# EAGLE design uino-32u4 (EAGLE 5.11)
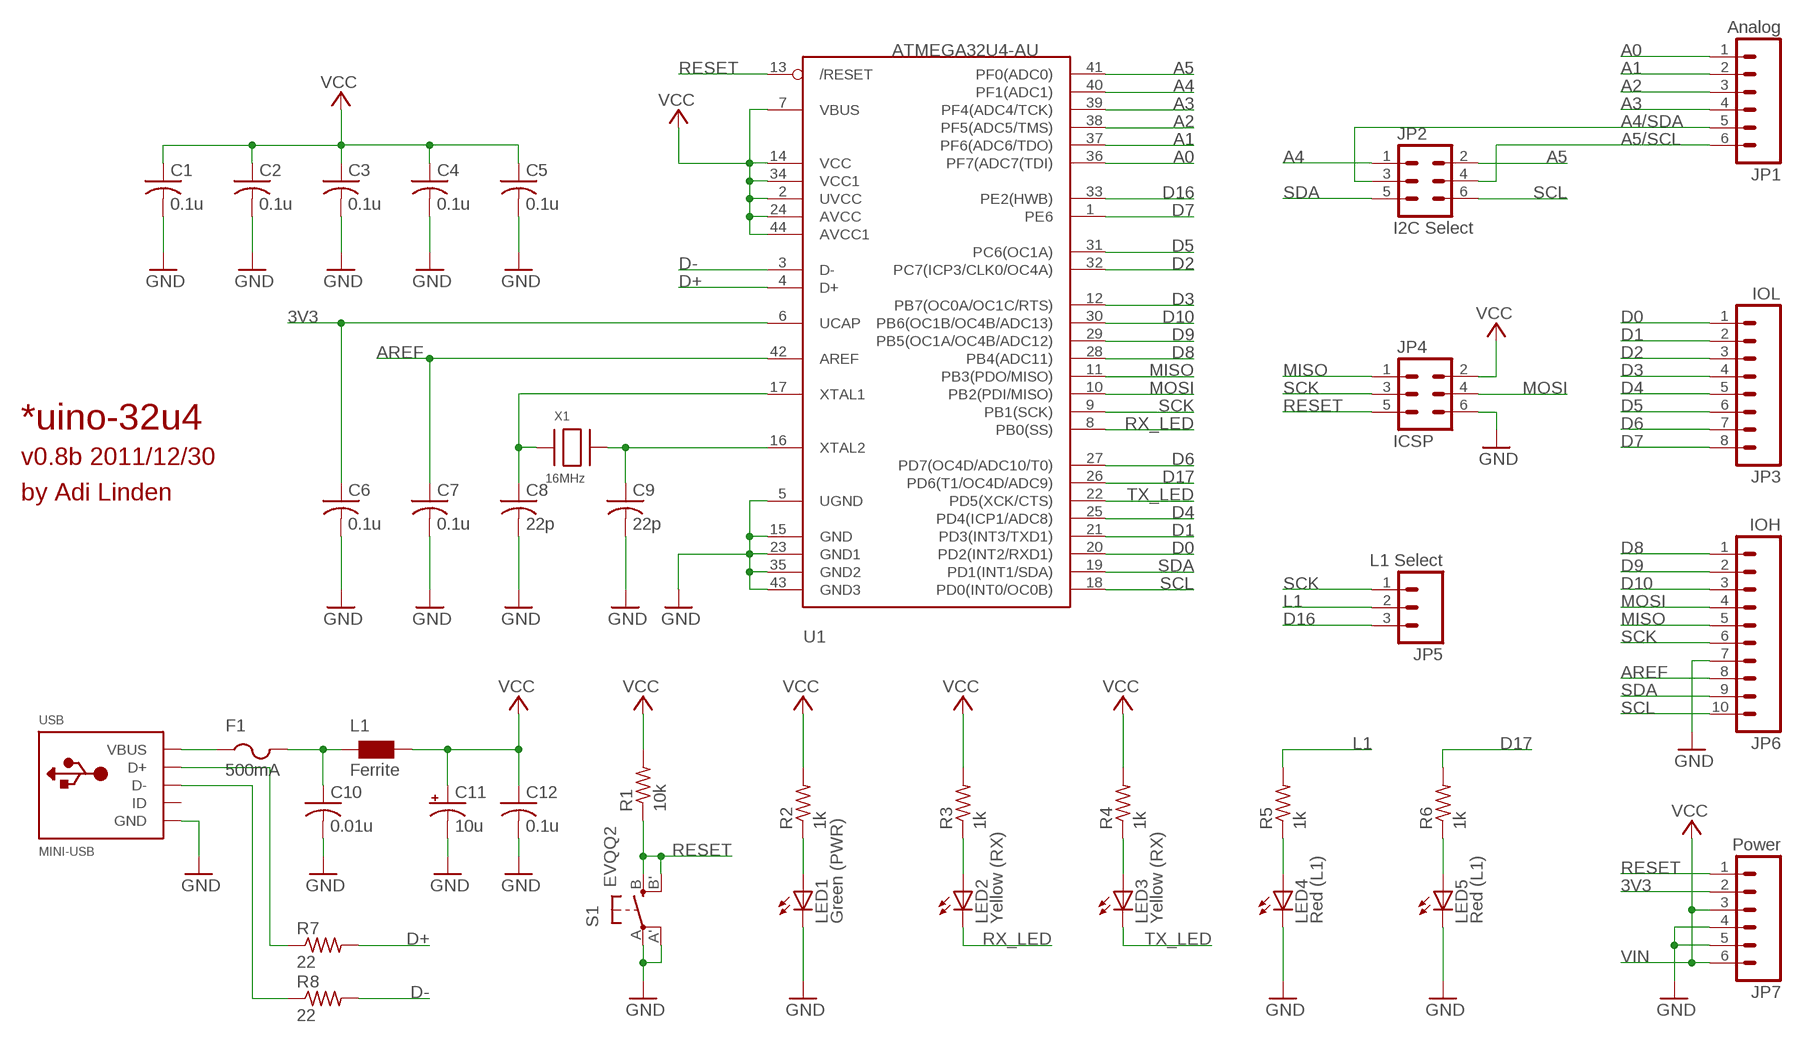
[diagram p0: schematic, sheet 1]

## Parts
C1  0.1u  C-USC0805  [C0805]
C2  0.1u  C-USC0805  [C0805]
C3  0.1u  C-USC0805  [C0805]
C4  0.1u  C-USC0805  [C0805]
C5  0.1u  C-USC0805  [C0805]
C6  0.1u  C-USC0805  [C0805]
C7  0.1u  C-USC0805  [C0805]
C8  22p  C-USC0805  [C0805]
C9  22p  C-USC0805  [C0805]
C10  0.01u  C-USC0805  [C0805]
C11  10u  CPOL-USCT3216  [CT3216]
C12  0.1u  C-USC0805  [C0805]
F1  500mA  PTCFUSE-1206  [R1206]
JP1  Analog  M06SIP  [1X06]
JP2  I2C Select  M03X2  [3X2]
JP3  IOL  M081X08  [1X08]
JP4  ICSP  M03X2  [3X2]
JP5  L1 Select  M03PTH  [1X03]
JP6  IOH  M101X08  [1X10]
JP7  Power  M06SIP  [1X06]
L1  Ferrite  WE-CBF_0805  [0805]
LED1  Green (PWR)  LEDCHIP-LED0805  [CHIP-LED0805]
LED2  Yellow (RX)  LEDCHIP-LED0805  [CHIP-LED0805]
LED3  Yellow (RX)  LEDCHIP-LED0805  [CHIP-LED0805]
LED4  Red (L1)  LEDCHIP-LED0805  [CHIP-LED0805]
LED5  Red (L1)  LEDCHIP-LED0805  [CHIP-LED0805]
R1  10k  R-US_R0805  [R0805]
R2  1k  R-US_R0805  [R0805]
R3  1k  R-US_R0805  [R0805]
R4  1k  R-US_R0805  [R0805]
R5  1k  R-US_R0805  [R0805]
R6  1k  R-US_R0805  [R0805]
R7  22  R-US_R0805  [R0805]
R8  22  R-US_R0805  [R0805]
S1  EVQQ2  [EVQ-Q2]
U1  ATMEGA32U4-AU  [TQFP44]
USB  MINI-USB  USBMINIB  [USB-MINIB]
X1  16MHz  XTALNX5032  [NX5032]

## Nets
3V3: C6.1 JP7.2 U1.6(UCAP)
A0: JP1.1 U1.36(PF7(ADC7(TDI))
A1: JP1.2 U1.37(PF6(ADC6/TDO))
A2: JP1.3 U1.38(PF5(ADC5/TMS))
A3: JP1.4 U1.39(PF4(ADC4/TCK))
A4: JP2.1 U1.40(PF1(ADC1))
A4/SDA: JP1.5 JP2.3
A5: JP2.2 U1.41(PF0(ADC0))
A5/SCL: JP1.6 JP2.4
AREF: C7.1 JP6.8 U1.42(AREF)
D0: JP3.1 U1.20(PD2(INT2/RXD1))
D1: JP3.2 U1.21(PD3(INT3/TXD1))
D2: JP3.3 U1.32(PC7(ICP3/CLK0/OC4A))
D3: JP3.4 U1.12(PB7(OC0A/OC1C/RTS))
D4: JP3.5 U1.25(PD4(ICP1/ADC8))
D5: JP3.6 U1.31(PC6(OC1A))
D6: JP3.7 U1.27(PD7(OC4D/ADC10/T0))
D7: JP3.8 U1.1(PE6)
D8: JP6.1 U1.28(PB4(ADC11))
D9: JP6.2 U1.29(PB5(OC1A/OC4B/ADC12))
D10: JP6.3 U1.30(PB6(OC1B/OC4B/ADC13))
D16: JP5.3 U1.33(PE2(HWB))
D17: R6.2 U1.26(PD6(T1/OC4D/ADC9))
D+: R7.2 U1.4(D+)
D-: R8.2 U1.3(D-)
GND: C1.2 C2.2 C3.2 C4.2 C5.2 C6.2 C7.2 C8.2 C9.2 C10.2 C11.- C12.2 JP4.6 JP6.7 JP7.4 JP7.5 LED1.C LED4.C LED5.C S1.A'(P1) S1.A(P) U1.5(UGND) U1.15(GND) U1.23(GND1) U1.35(GND2) U1.43(GND3) USB.GND
L1: JP5.2 R5.2
MISO: JP4.1 JP6.5 U1.11(PB3(PDO/MISO))
MOSI: JP4.4 JP6.4 U1.10(PB2(PDI/MISO))
N$1: C10.1 F1.2 L1.1
N$2: R7.1 USB.D+
N$3: R8.1 USB.D-
N$4: LED2.A R3.1
N$5: LED3.A R4.1
N$6: LED4.A R5.1
N$7: LED5.A R6.1
N$8: LED1.A R2.1
N$9: C9.1 U1.16(XTAL2) X1.P$2
N$10: C8.1 U1.17(XTAL1) X1.P$1
RESET: JP4.5 JP7.1 R1.1 S1.B'(S1) S1.B(S) U1.13(/RESET)
RX_LED: LED2.C U1.8(PB0(SS))
SCK: JP4.3 JP5.1 JP6.6 U1.9(PB1(SCK))
SCL: JP2.6 JP6.10 U1.18(PD0(INT0/OC0B))
SDA: JP2.5 JP6.9 U1.19(PD1(INT1/SDA))
TX_LED: LED3.C U1.22(PD5(XCK/CTS))
VBUS: F1.1 USB.VBUS
VCC: C1.1 C2.1 C3.1 C4.1 C5.1 C11.+ C12.1 JP4.2 JP7.3 JP7.6 L1.2 R1.2 R2.2 R3.2 R4.2 U1.2(UVCC) U1.7(VBUS) U1.14(VCC) U1.24(AVCC) U1.34(VCC1) U1.44(AVCC1)
Unconnected: USB.ID

## Notes on the sheet
- *uino-32u4
- v0.8b 2011/12/30
- by Adi Linden
- VIN

## Library data of the parts
C1-C10 C12 = adafruit:C-US: CAPACITOR, American symbol
C11 = adafruit:CPOL-US: POLARIZED CAPACITOR, American symbol
F1 = adafruit:PTCFUSE: PTC fuses, resettable thermistors
JP1 JP7 = SparkFun:M06: Header 6 Standard 6-pin 0.1" header. Use with straight break away headers (SKU : PRT-00116), right angle break away headers (PRT-00553), swiss pins (PRT-00743), machine pins (PRT-00117), and female headers (PRT-00115). Molex polarized connector foot print use with SKU : PRT-08094 with associated crimp pins and housings. NOTES ON THE VARIANTS LOCK and LOCK_LONGPADS... This footprint was designed to help hold the alignment of a through-hole component (i.e. 6-pin header) while soldering it into place. You may notice that each hole has been shifted either up or down by 0.005 of an inch from it's more standard position (which is a perfectly straight line). This slight alteration caused the pins (the squares in the middle) to touch the edges of the holes. Because they are alternating, it causes a "brace" to hold the component in place. 0.005 has proven to be the perfect amount of "off-center" position when using our standard breakaway headers. Although looks a little odd when you look at the bare footprint, once you have a header in there, the alteration is very hard to notice. Also, if you push a header all the way into place, it is covered up entirely on the bottom side. This idea of altering the position of holes to aid alignment will be further integrated into the Sparkfun Library for other footprints. It can help hold any component with 3 or more connection pins.
JP2 JP4 = adilinden:M03X2: This is a 3x2 pin header based on the Sparkfun library 4x2 header.
JP3 = SparkFun:M08: Header 8 Standard 8-pin 0.1" header. Use with straight break away headers (SKU : PRT-00116), right angle break away headers (PRT-00553), swiss pins (PRT-00743), machine pins (PRT-00117), and female headers (PRT-00115).
JP5 = SparkFun:M03: Header 3 Standard 3-pin 0.1" header. Use with straight break away headers (SKU : PRT-00116), right angle break away headers (PRT-00553), swiss pins (PRT-00743), machine pins (PRT-00117), and female headers (PRT-00115). Molex polarized connector foot print use with SKU : PRT-08232 with associated crimp pins and housings.
JP6 = adilinden:M10: Header 10 Standard 10-pin 0.1" header. Use with straight break away headers (SKU : PRT-00116), right angle break away headers (PRT-00553), swiss pins (PRT-00743), machine pins (PRT-00117), and female headers (PRT-00115). Note: This part is based on the Sparkfun M08 library part.
L1 = wuerth-elektronik:WE-CBF: SMD EMI Suppression Ferrite Beads - excellent anti-EMI properties - low DCR - impedances till 3000 ohms - rated current up to 6 A
LED1-LED5 = adafruit:LED: LED OSRAM: - CHIPLED LG R971, LG N971, LY N971, LG Q971, LY Q971, LO R971, LY R971 LH N974, LH R974 LS Q976, LO Q976, LY Q976 LO Q996 - Hyper CHIPLED LW Q18S LB Q993, LB Q99A, LB R99A - SideLED LS A670, LO A670, LY A670, LG A670, LP A670 LB A673, LV A673, LT A673, LW A673 LH A674 LY A675 LS A676, LA A676, LO A676, LY A676, LW A676 LS A679, LY A679, LG A679 - Hyper Micro SIDELED® LS Y876, LA Y876, LO Y876, LY Y876 LT Y87S - SmartLED LW L88C, LW L88S LB L89C, LB L89S, LG L890 LS L89K, LO L89K, LY L89K LS L896, LA L896, LO L896, LY L896 - TOPLED LS T670, LO T670, LY T670, LG T670, LP T670 LSG T670, LSP T670, LSY T670, LOP T670, LYG T670 LG T671, LOG T671, LSG T671 LB T673, LV T673, LT T673, LW T673 LH T674 LS T676, LA T676, LO T676, LY T676, LB T676, LH T676, LSB T676, LW T676 LB T67C, LV T67C, LT T67C, LS T67K, LO T67K, LY T67K, LW E67C LS E67B, LA E67B, LO E67B, LY E67B, LB E67C, LV E67C, LT E67C LW T67C LS T679, LY T679, LG T679 LS T770, LO T770, LY T770, LG T770, LP T770 LB T773, LV T773, LT T773, LW T773 LH T774 LS E675, LA E675, LY E675, LS T675 LS T776, LA T776, LO T776, LY T776, LB T776 LHGB T686 LT T68C, LB T68C - Hyper Mini TOPLED® LB M676 - Mini TOPLED Santana® LG M470 LS M47K, LO M47K, LY M47K Source: http://www.osram.convergy.de/
R1-R8 = resistor:R-US_: RESISTOR, American symbol
S1 = adafruit:EVQQ2: SMT 6mm switch, EVQQ2 series http://www.ladyada.net/library/eagle
U1 = adafruit:ATMEGA32U4: http://www.ladyada.net/library/eagle
USB = adafruit:USB: USB Connectors USBMINIB - Surface Mount Female Mini-B USB Connector 4UConnector: 06564 By microbuilder.eu Thru-hole RA Female Mini-B USB Connector 4UConnector: 18732 By ladyada.net
X1 = adafruit:XTAL: Low cost SMT crystals, no capacitors included http://www.ladyada.net/library/eagle

## Board
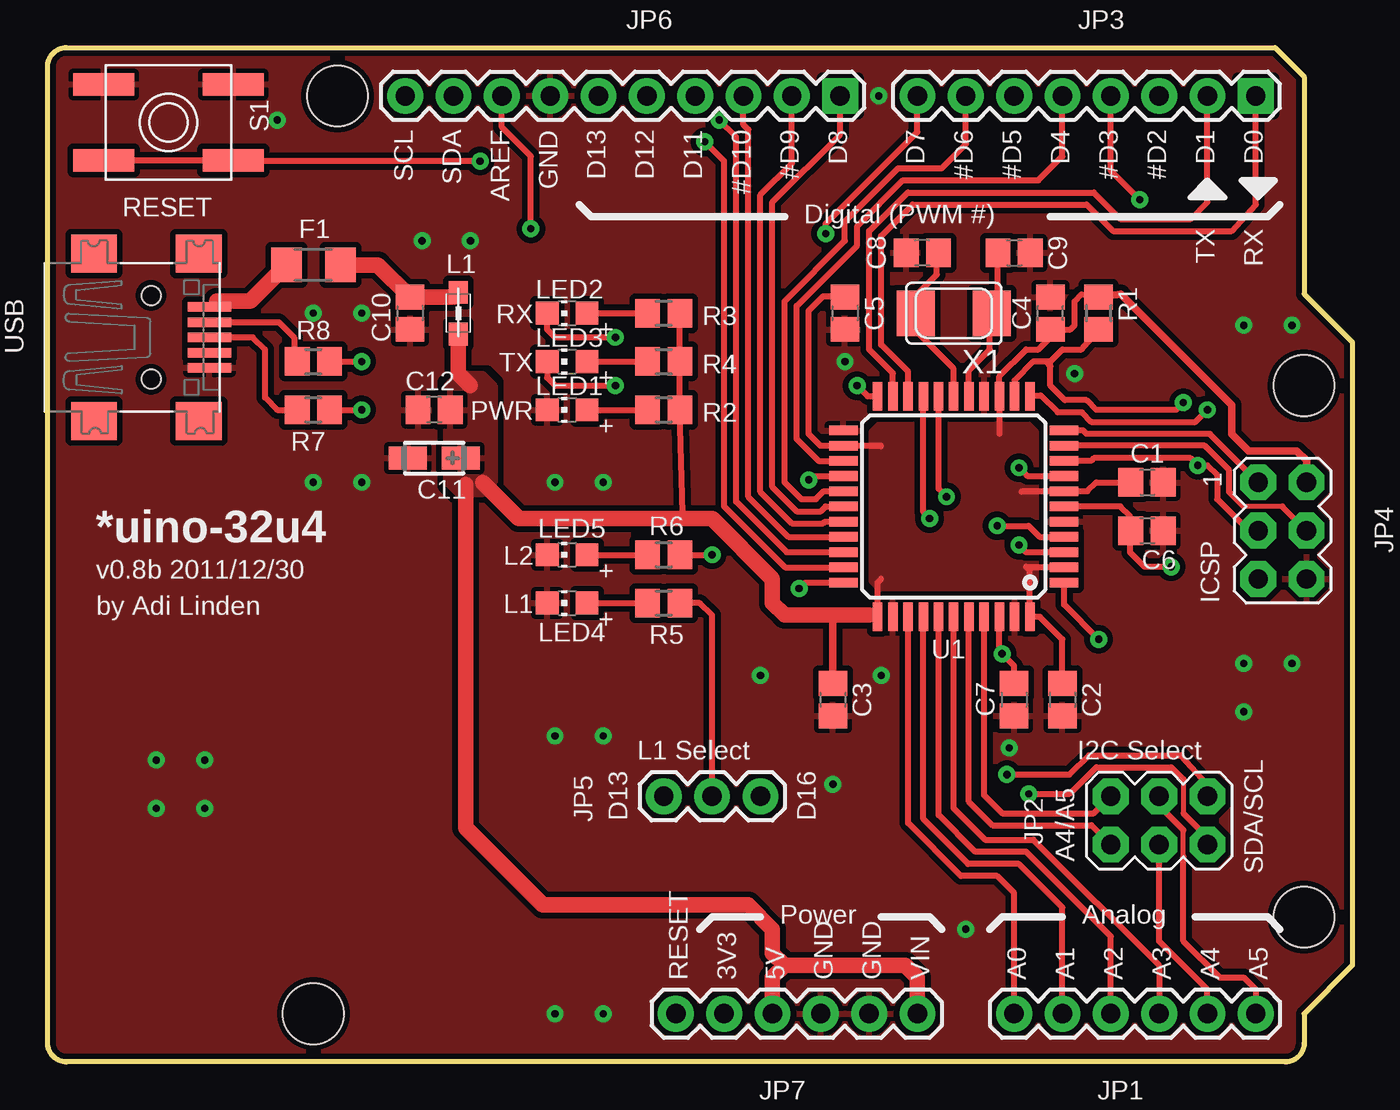
[diagram p1: board, top side]
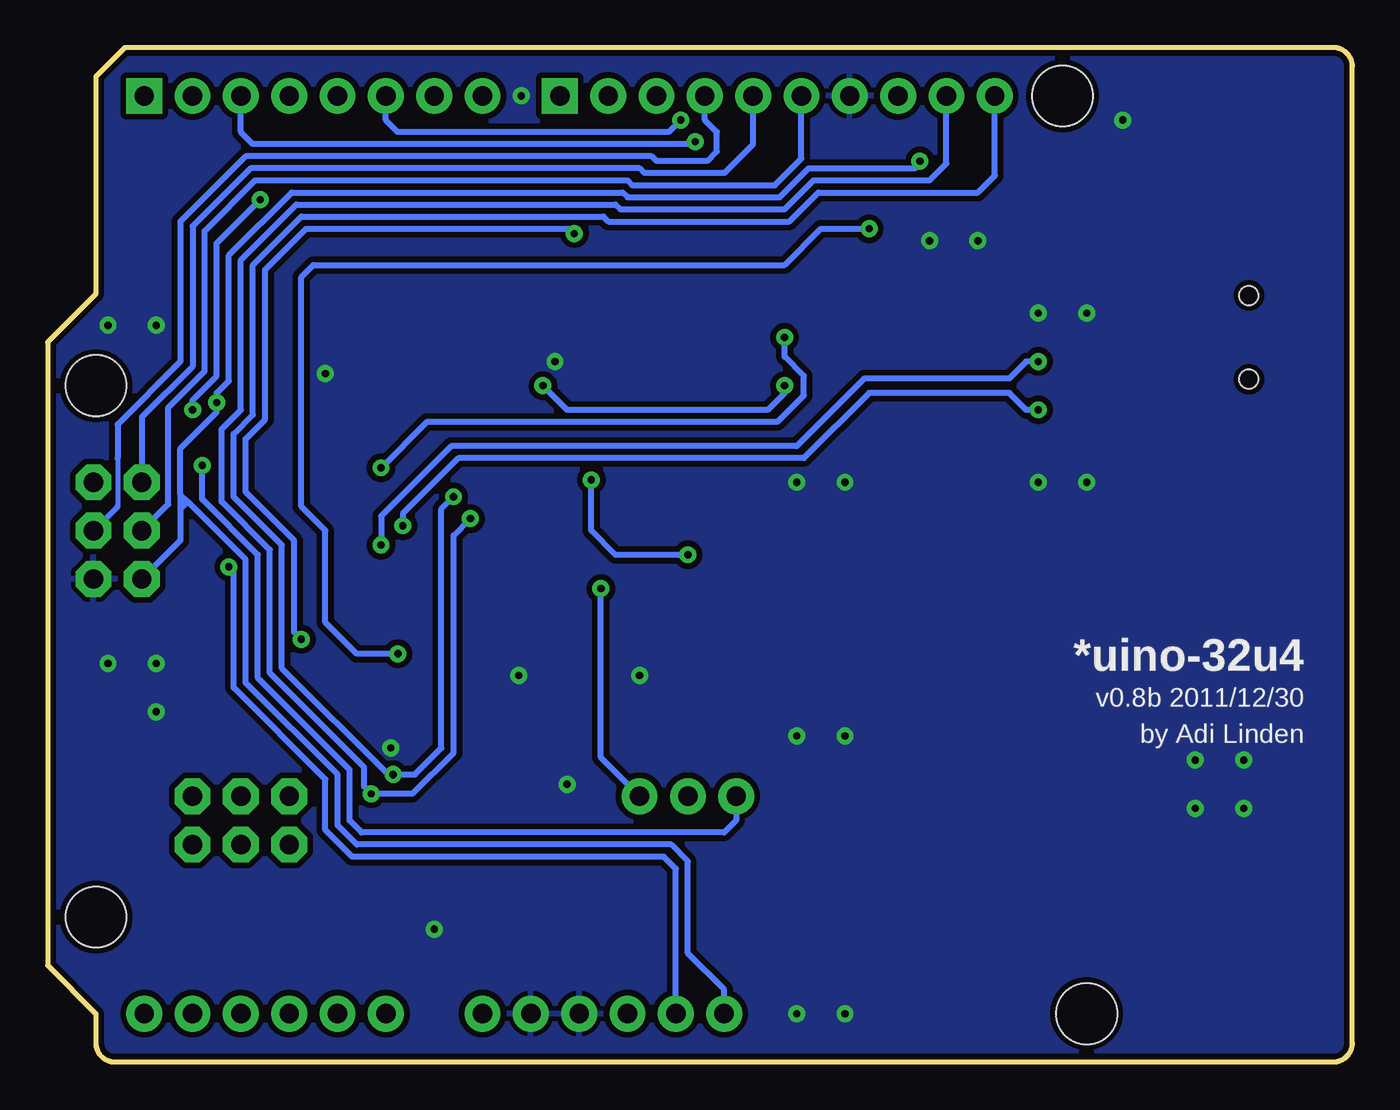
[diagram p2: board, bottom side, seen from below]

Size 68.58 x 53.34 mm. Coordinates in mm from the lower left corner, seen from the top.
Outline: 64.52,53.34 66.04,51.82 66.04,40.39 68.58,37.85 68.58,5.08 66.04,2.54 66.04,1 arc-90 65.04,0 1,0 arc-90 0,1 0,52.34 arc-90 1,53.34 64.52,53.34
Copper layers (1*16): Top 0.035mm / dielectric 1.5mm / Bottom 0.035mm
Design rules "Fusion_eagle_rule_v1.1": minimum track width 6mil, minimum drill 12mil, track to track 6mil, track to pad 6mil, pad to pad 6mil, via to via 6mil, smd to smd 0mil, copper to edge 10mil, drill to drill 10mil, minimum pad ring 10mil, minimum via ring 6mil, stop-mask expansion 2mil, vias tented up to drill 100mil, thermal gap 10mil
Holes 3.2 mm at 66.04,35.56 66.04,7.62 15.24,50.8 13.97,2.54

### Footprints (pad centres in the part's own frame; a part is rotated, then mirrored left to right if it is on the bottom)
C0805 = smd 1.3 x 1.5: 1 -0.85,0; 2 0.85,0
CT3216 = smd 2 x 1.2: + 1.4,0; - -1.4,0
R1206 = smd 1.6 x 1.803: 1 -1.422,0; 2 1.422,0
1X06 = drill 1.016 pad 1.88 round: 1 0,0; 2 2.54,0; 3 5.08,0; 4 7.62,0; 5 10.16,0; 6 12.7,0
3X2 = drill 1.016 pad 1.88 octagon: 1 -2.54,-1.27; 2 -2.54,1.27; 3 0,-1.27; 4 0,1.27; 5 2.54,-1.27; 6 2.54,1.27
1X08 = drill 1.016 pad 1.88 square: 1 0,0 | drill 1.016 pad 1.88 round: 2 2.54,0; 3 5.08,0; 4 7.62,0; 5 10.16,0; 6 12.7,0; 7 15.24,0; 8 17.78,0
1X03 = drill 1.016 pad 1.88 round: 1 0,0; 2 2.54,0; 3 5.08,0
1X10 = drill 1.016 pad 1.88 square: 1 0,0 | drill 1.016 pad 1.88 round: 2 2.54,0; 3 5.08,0; 4 7.62,0; 5 10.16,0; 6 12.7,0; 7 15.24,0; 8 17.78,0; 9 20.32,0; 10 22.86,0
0805 = smd 1.2 x 1: 1 -1.1,0; 2 1.1,0
CHIP-LED0805 = smd 1.2 x 1.2: A 0,-1.05; C 0,1.05
R0805 = smd 1.3 x 1.5: 1 -0.85,0; 2 0.85,0
EVQ-Q2 = smd 3.2 x 1.2: A -3.4,-2; A' 3.4,-2; B -3.4,2; B' 3.4,2
TQFP44 = smd 1.5 x 0.5: 1 -5.8,4; 2 -5.8,3.2; 3 -5.8,2.4; 4 -5.8,1.6; 5 -5.8,0.8; 6 -5.8,0; 7 -5.8,-0.8; 8 -5.8,-1.6; 9 -5.8,-2.4; 10 -5.8,-3.2; 11 -5.8,-4; 23 5.8,-4; 24 5.8,-3.2; 25 5.8,-2.4; 26 5.8,-1.6; 27 5.8,-0.8; 28 5.8,0; 29 5.8,0.8; 30 5.8,1.6; 31 5.8,2.4; 32 5.8,3.2; 33 5.8,4 | smd 0.5 x 1.5: 12 -4,-5.8; 13 -3.2,-5.8; 14 -2.4,-5.8; 15 -1.6,-5.8; 16 -0.8,-5.8; 17 0,-5.8; 18 0.8,-5.8; 19 1.6,-5.8; 20 2.4,-5.8; 21 3.2,-5.8; 22 4,-5.8; 34 4,5.8; 35 3.2,5.8; 36 2.4,5.8; 37 1.6,5.8; 38 0.8,5.8; 39 0,5.8; 40 -0.8,5.8; 41 -1.6,5.8; 42 -2.4,5.8; 43 -3.2,5.8; 44 -4,5.8
USB-MINIB = smd 0.5 x 2.308: D+ 0,4.064; D- -0.8,4.064; GND 1.6,4.064; ID 0.8,4.064; VBUS -1.6,4.064 | smd 2 x 2.4: GND1 -4.4,-2; GND2 -4.4,3.5; GND3 4.4,3.5; GND4 4.4,-2 | hole 1: -2.2,1; 2.2,1
NX5032 = smd 2 x 2.4: P$1 2,0; P$2 -2,0

### Placement (x,y rotation side)
C1  57.78,30.48 0 top
C2  53.34,19.05 270 top
C3  41.27,19.05 270 top
C4  52.7,39.37 90 top
C5  41.91,39.37 270 top
C6  57.78,27.94 0 top
C7  50.8,19.05 270 top
C8  45.97,42.55 180 top
C9  50.8,42.55 0 top
C10  19.05,39.37 270 top
C11  20.32,31.75 0 top
C12  20.32,34.29 180 top
F1  13.97,41.91 0 top
JP1  50.8,2.54 0 top
JP2  58.42,12.7 0 top
JP3  63.5,50.8 180 top
JP4  64.9,27.94 270 top
JP5  32.38,13.97 0 top
JP6  41.66,50.8 180 top
JP7  33.02,2.54 0 top
L1  21.59,39.37 270 top
LED1  27.3,34.29 90 top
LED2  27.3,39.37 90 top
LED3  27.3,36.83 90 top
LED4  27.3,24.13 90 top
LED5  27.3,26.67 90 top
R1  55.24,39.37 90 top
R2  32.38,34.29 0 top
R3  32.38,39.37 0 top
R4  32.38,36.83 0 top
R5  32.38,24.13 0 top
R6  32.38,26.67 0 top
R7  13.97,34.29 0 top
R8  13.97,36.83 0 top
S1  6.35,49.4 180 top
U1  47.62,29.21 180 top
USB  4.45,38.1 270 top
X1  47.62,39.37 180 top

### Tracks (layer width: path | path; a pad name or v marks a point on that pad's centre or on a via)
3V3  (via drill 0.38 pad 0.89)
  Top 0.305: v59.05,26.04 57.66,26.04 56.9,26.8 56.9,27.9 C6.1 56.9,27.98 56.9,28.7 56.39,29.21 U1.6
  Bottom 0.305: JP7.2 35.56,10.16 36.2,10.79 52.58,10.79 53.98,12.19 53.98,14.86 58.8,19.68 58.8,25.78 v59.05,26.04
A0
  Top 0.305: U1.36 45.23,12.56 48.01,9.78 49.91,9.78 50.8,8.89 JP1.1
A1
  Top 0.305: U1.37 46.02,12.78 48.39,10.41 51.05,10.41 53.34,8.13 JP1.2
A2
  Top 0.305: U1.38 46.83,12.99 48.77,11.05 51.44,11.05 55.88,6.6 JP1.3
A3
  Top 0.305: U1.39 47.62,13.34 49.28,11.68 51.82,11.68 58.42,5.08 JP1.4
A4
  Top 0.305: U1.40 48.42,13.68 49.66,12.45 54.86,12.45 JP2.1
A4/SDA
  Top 0.305: JP2.3 58.42,6.35 60.96,3.81 JP1.5
A5
  Top 0.305: U1.41 49.23,14.02 50.16,13.08 54.99,13.08 JP2.2
A5/SCL
  Top 0.254: 59.69,10.79 59.69,12.19
  Top 0.305: JP1.6 63.5,3.81 62.87,4.45 61.59,4.45 59.69,6.35 59.69,10.79 | JP2.4 58.42,13.46 59.69,12.19
AREF  (via drill 0.38 pad 0.89)
  Top 0.305: JP6.8 23.88,49.15 25.4,47.62 v25.4,43.81 | U1.42 50.02,21.6 v50.16,21.46 50.8,20.83 C7.1
  Bottom 0.305: v25.4,43.81 27.94,43.81 29.84,41.91 54.61,41.91 55.24,41.27 55.24,29.21 53.98,27.94 53.98,23.11 52.32,21.46 v50.16,21.46
D0
  Top 0.305: JP3.1 63.5,45.09 62.23,43.69 56.01,43.69 54.61,45.09 45.47,45.09 43.81,43.43 43.81,37.72 45.23,36.31 U1.20
D1
  Top 0.305: U1.21 44.42,36.22 43.18,37.47 43.18,43.69 45.21,45.72 54.99,45.72 56.39,44.32 60.07,44.32 60.96,45.21 JP3.2
D2  (via drill 0.38 pad 0.89)
  Top 0.305: U1.32 38.76,26.01 35.56,29.21 35.56,47.37 v34.54,48.39
  Bottom 0.305: JP3.3 58.42,48.9 57.78,48.26 34.67,48.26 v34.54,48.39
D3  (via drill 0.38 pad 0.89)
  Top 0.305: JP3.4 55.88,46.86 v57.4,45.34 | v60.96,34.29 60.33,33.66 54.86,33.66 54.36,34.16 53.09,34.16 52.2,35.05 51.67,35.05 U1.12 51.71,34.92
  Bottom 0.305: v60.96,34.29 60.96,34.8 59.69,36.07 59.69,43.05 v57.4,45.34
D4
  Top 0.305: U1.25 40.53,31.61 39.37,32.77 39.37,39.75 42.55,42.93 42.55,43.94 44.96,46.35 52.07,46.35 53.34,47.62 JP3.5
D5  (via drill 0.38 pad 0.89)
  Top 0.305: U1.31 38.85,26.81 36.2,29.46 36.2,48.64 v35.31,49.53
  Bottom 0.305: JP3.6 50.8,49.53 50.16,48.9 35.94,48.9 v35.31,49.53
D6
  Top 0.305: JP3.7 48.26,48.26 46.99,46.99 44.7,46.99 41.91,44.2 41.91,43.18 38.73,40.01 38.73,30.48 39.62,29.59 40.39,29.59 40.8,30.01 U1.27
D7  (via drill 0.38 pad 0.89)
  Top 0.305: JP3.8 45.72,48.9 40.89,44.07 v40.89,43.56 | U1.1 53.42,24.05 v55.24,22.23
  Bottom 0.305: v40.89,43.56 41.15,43.81 54.99,43.81 57.15,41.66 57.15,33.78 58.17,32.77 58.17,29.97 55.63,27.43 55.63,22.61 v55.24,22.23
D8
  Top 0.305: JP6.1 41.66,48.77 38.1,45.21 38.1,30.23 39.37,28.96 40.64,28.96 40.89,29.21 U1.28
D9
  Top 0.305: JP6.2 39.12,47.24 37.47,45.59 37.47,29.97 39.12,28.32 40.77,28.32 40.86,28.41 U1.29
D10
  Top 0.305: JP6.3 36.58,49.28 36.83,49.02 36.83,29.72 38.94,27.61 U1.30
D16  (via drill 0.38 pad 0.89)
  Top 0.305: U1.33 39.81,25.21 v39.5,24.89
  Bottom 0.305: v39.5,24.89 39.5,16 JP5.3
D17  (via drill 0.38 pad 0.89)
  Top 0.305: R6.2 v34.92,26.67 | U1.26 40.21,30.81 v40.01,30.61
  Bottom 0.305: v40.01,30.61 40.01,27.94 38.73,26.67 v34.92,26.67
D+  (via drill 0.38 pad 0.89)
  Top 0.305: R7.2 v16.51,34.29 | U1.4 52.15,27.61 51.56,28.19 v49.91,28.19
  Bottom 0.305: v16.51,34.29 17.14,34.29 18.03,35.18 25.4,35.18 28.83,31.75 46.99,31.75 49.91,28.83 v49.91,28.19
D-  (via drill 0.38 pad 0.89)
  Top 0.305: R8.2 v16.51,36.83 | U1.3 51.42,26.81 v51.05,27.18
  Bottom 0.305: v16.51,36.83 17.14,36.83 18.03,35.94 25.65,35.94 29.21,32.38 47.37,32.38 51.05,28.7 v51.05,27.18
GND  (via drill 0.38 pad 0.89)
  other vias: 62.87,18.41 62.87,20.95 43.69,50.8 41.27,14.61 43.81,20.32 37.47,20.32 26.67,17.14 29.21,17.14 5.71,15.88 8.26,15.88 8.26,13.34 5.71,13.34 29.21,2.54 26.67,2.54 41.91,36.83 22.23,43.18 19.68,43.18 12.06,49.53 13.97,39.37 16.51,39.37 13.97,30.48 16.51,30.48 26.67,30.48 29.21,30.48 48.26,6.99 50.55,16.51 65.41,20.95 62.87,38.73 65.41,38.73 53.98,36.2
  pour Top (isolate 0.305, rank 2): 0,0 0,53.34 68.58,53.34 68.58,0
  pour Bottom (isolate 0.305): 68.58,53.34 68.58,0 0,0 0,53.34
L1
  Top 0.305: JP5.2 34.92,23.5 34.29,24.13 R5.2
MISO
  Top 0.305: U1.11 54.42,33.21 54.61,33.02 61.09,33.02 JP4.1
  Bottom 0.305: JP6.5 31.5,48.26 33.02,46.74 37.21,46.74 37.47,46.99 57.91,46.99 60.96,43.94 60.96,36.58 63.63,33.91 JP4.1
MOSI
  Top 0.254: 64.9,29.21 62.87,29.21
  Top 0.305: 62.87,29.21 62.1,29.97 62.1,31.11 60.81,32.41 U1.10 | JP4.4 64.9,29.21
  Bottom 0.254: 64.9,31.75 64.9,29.21
  Bottom 0.305: 64.9,29.21 JP4.4 | 64.9,31.75 64.9,33.53 61.59,36.83 61.59,44.2 58.17,47.62 36.83,47.62 36.58,47.37 33.91,47.37 33.4,47.88 33.4,48.9 34.04,49.53 JP6.4
N$1
  Top 0.813: F1.2 17.36,41.91 C10.1 21.34,40.22 L1.1
N$2
  Top 0.305: USB.D+ 10.79,38.1 11.43,37.47 11.43,34.92 12.06,34.29 R7.1
N$3
  Top 0.305: USB.D- 12.15,38.9 12.95,38.1 12.95,36.85 R8.1
N$4
  Top 0.305: LED2.A R3.1
N$5
  Top 0.305: LED3.A R4.1
N$6
  Top 0.305: LED4.A R5.1
N$7
  Top 0.305: LED5.A R6.1
N$8
  Top 0.305: LED1.A R2.1
N$9
  Top 0.305: U1.16 48.42,36.36 49.53,37.47 49.53,39.27 X1.P$2 | X1.P$2 50.16,39.27 | C9.1 49.95,39.7 X1.P$2
N$10
  Top 0.305: X1.P$1 46.35,39.27 | X1.P$1 46.14,39.49 | X1.P$1 45.72,39.27 | X1.P$1 45.76,39.5 45.76,40.42 46.74,41.4 46.74,42.46 C8.1 | U1.17 47.62,36.45 45.62,38.45 X1.P$1
RESET  (via drill 0.38 pad 0.89)
  Top 0.305: v22.73,47.37 9.78,47.37 S1.B S1.B' | U1.13 50.83,35.84 51.82,36.83 52.45,36.83 | v59.69,34.67 59.31,34.29 55.12,34.29 54.61,34.8 53.47,34.8 52.7,35.56 52.7,36.58 | 52.7,36.83 52.45,36.83 | 52.7,36.83 53.34,37.47 54.34,37.47 R1.1 | 52.7,36.58 52.7,36.83 | 52.7,36.58 52.45,36.83
  Bottom 0.305: JP7.1 33.02,3.81 34.92,5.71 34.92,10.54 35.81,11.43 52.32,11.43 53.34,12.45 53.34,15.11 58.17,19.94 58.17,26.42 61.21,29.46 | JP4.5 61.59,27.43 61.59,29.08 | 61.59,29.84 61.59,32.26 59.69,34.16 v59.69,34.67 59.69,35.18 59.05,35.81 59.05,42.42 55.75,45.72 38.35,45.72 38.1,45.47 30.1,45.47 28.57,46.99 22.99,46.99 22.73,47.24 v22.73,47.37 | 61.59,29.84 61.59,29.08 | 61.21,29.46 61.59,29.84 | 61.21,29.46 61.59,29.08
RX_LED  (via drill 0.38 pad 0.89)
  Top 0.305: LED2.C 26.25,38.52 26.67,38.1 v29.84,38.1 | U1.8 51.49,30.81 v51.05,31.24
  Bottom 0.305: v51.05,31.24 48.64,33.66 30.23,33.66 28.83,35.05 28.83,36.07 29.84,37.08 v29.84,38.1
SCK  (via drill 0.38 pad 0.89)
  Top 0.305: JP4.3 63.12,27.94 61.47,29.59 61.47,30.86 60.96,31.37 v60.45,31.37 60.07,31.75 54.99,31.75 54.85,31.61 U1.9
  Bottom 0.305: JP6.6 28.96,47.5 30.35,46.1 37.85,46.1 38.1,46.35 57.66,46.35 60.33,43.69 60.33,36.32 62.23,34.42 62.23,29.34 JP4.3 | JP5.1 32.38,12.7 33.02,12.06 52.07,12.06 52.7,12.7 52.7,15.37 57.53,20.19 57.53,26.67 60.45,29.59 v60.45,31.37
SCL  (via drill 0.38 pad 0.89)
  Top 0.305: JP2.6 60.96,14.61 59.56,16.13 54.74,16.13 53.72,15.11 v50.42,15.11 | U1.18 46.83,30.14 v47.24,29.72
  Bottom 0.305: JP6.10 18.8,46.61 19.68,45.72 28.07,45.72 29.59,44.2 39.12,44.2 39.37,44.45 55.24,44.45 57.78,41.91 57.78,34.04 58.8,33.02 58.8,29.72 56.26,27.18 56.26,20.7 50.67,15.11 v50.42,15.11 49.28,15.11 47.88,16.51 47.88,29.08 v47.24,29.72
SDA  (via drill 0.38 pad 0.89)
  Top 0.254: 59.69,14.86 59.69,13.08
  Top 0.305: JP2.5 60.96,11.81 59.69,13.08 | 59.69,14.86 59.05,15.49 55.12,15.49 53.72,14.1 v51.56,14.1 | U1.19 46.02,28.91 v46.35,28.57
  Bottom 0.305: JP6.9 21.34,47.24 22.23,46.35 28.32,46.35 29.84,44.83 38.48,44.83 38.73,45.09 55.5,45.09 58.42,42.16 58.42,34.29 59.44,33.27 59.44,29.46 56.9,26.92 56.9,20.45 51.94,15.49 51.94,14.48 v51.56,14.1 49.4,14.1 47.24,16.26 47.24,27.69 v46.35,28.57
TX_LED  (via drill 0.38 pad 0.89)
  Top 0.305: LED3.C 26.25,35.98 26.67,35.56 v29.84,35.56 | v42.55,35.56 43.09,35.01 U1.22
  Bottom 0.305: v42.55,35.56 41.27,34.29 30.73,34.29 29.84,35.18 v29.84,35.56
VBUS
  Top 0.305: USB.VBUS 8.59,39.7 8.89,40.01
  Top 0.813: 8.89,40.01 10.64,40.01 F1.1
VCC
  Top 0.305: R3.2 R4.2 R2.2 33.38,28.84 33.66,28.57 | U1.2 53.4,26.04 51.44,26.04 51.62,25.84 U1.44 52.16,23.41 53.34,22.23 C2.1 | 43.81,32.38 43.79,32.41 U1.24 40.62,32.41 40.01,33.02 40.01,39.5 40.77,40.26 41.87,40.26 C5.1 | 50.04,33.02 50.02,33.03 U1.14 50.02,36.05 51.44,37.47 52.07,37.47 52.7,38.1 C4.1 53.76,38.52 53.98,38.73 53.98,40.01 54.34,40.37 R1.2 55.26,40.39 | U1.34 43.62,25.21 43.81,25.4 | 51.18,29.97 51.22,30.01 U1.7 54.65,30.01 55.12,30.48 C1.1
  Top 0.406: 41.27,23.5 C3.1 | JP4.2 66.17,31.62 65.66,32.13 63.12,32.13 62.23,33.02 62.23,34.54 56.4,40.37 R1.2 | U1.34 43.27,23.41 43.18,23.5
  Top 0.813: JP7.6 45.72,4.45 45.09,5.08 38.73,5.08 | 38.73,5.08 38.1,4.45 JP7.3 | 38.73,5.08 38.1,5.71 38.1,6.99 36.83,8.26 26.04,8.26 21.97,12.32 21.97,30.35 | C12.1 20.95,34.51 | 22.86,30.48 24.77,28.57 33.66,28.57 34.92,28.57 38.1,25.4 38.1,24.13 38.73,23.5 41.27,23.5 43.18,23.5 | L1.2 21.59,36.2 22.23,35.56
  pour Top (isolate 0.305): 43.31,32.77 43.31,33.15 43.69,33.53 51.56,33.53 51.94,33.15 51.94,25.27 51.56,24.89 43.69,24.89 43.31,25.27 43.31,32.64
  pour Top: 20.95,30.48 20.95,35.56 21.59,36.2 22.86,36.2 23.5,35.56 23.5,30.48 22.86,29.84 21.59,29.84

### Text on the board
tPlace: SCL | SDA | AREF | GND | D13 | D12 | D11 | #D10 | #D9 | D8 | D7 | #D6 | #D5 | D4 | #D3 | #D2 | D1 | D0 | RESET | Digital (PWM #) | TX | RX | RX | TX | PWR | 1 | *uino-32u4 | L2 | v0.8b 2011/12/30 | L1 | ICSP | by Adi Linden | L1 Select | I2C Select | D13 | D16 | A4/A5 | SDA/SCL | Power | Analog | RESET | 3V3 | 5V | GND | GND | VIN | A0 | A1 | A2 | A3 | A4 | A5
bPlace: *uino-32u4 | v0.8b 2011/12/30 | by Adi Linden
tValues: 1